# EAGLE board Keyboard (EAGLE 6.3)
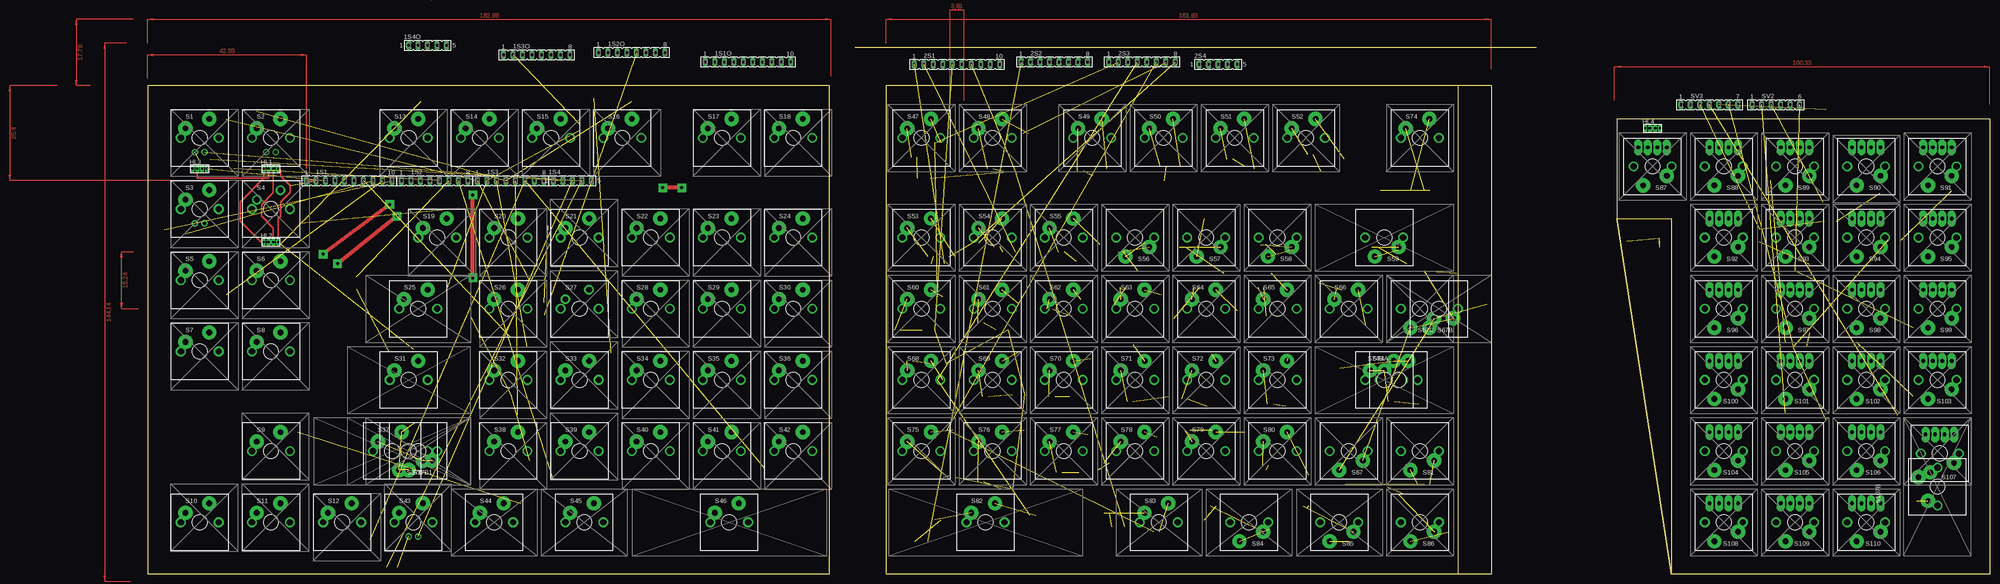
[diagram p2: board, top side]
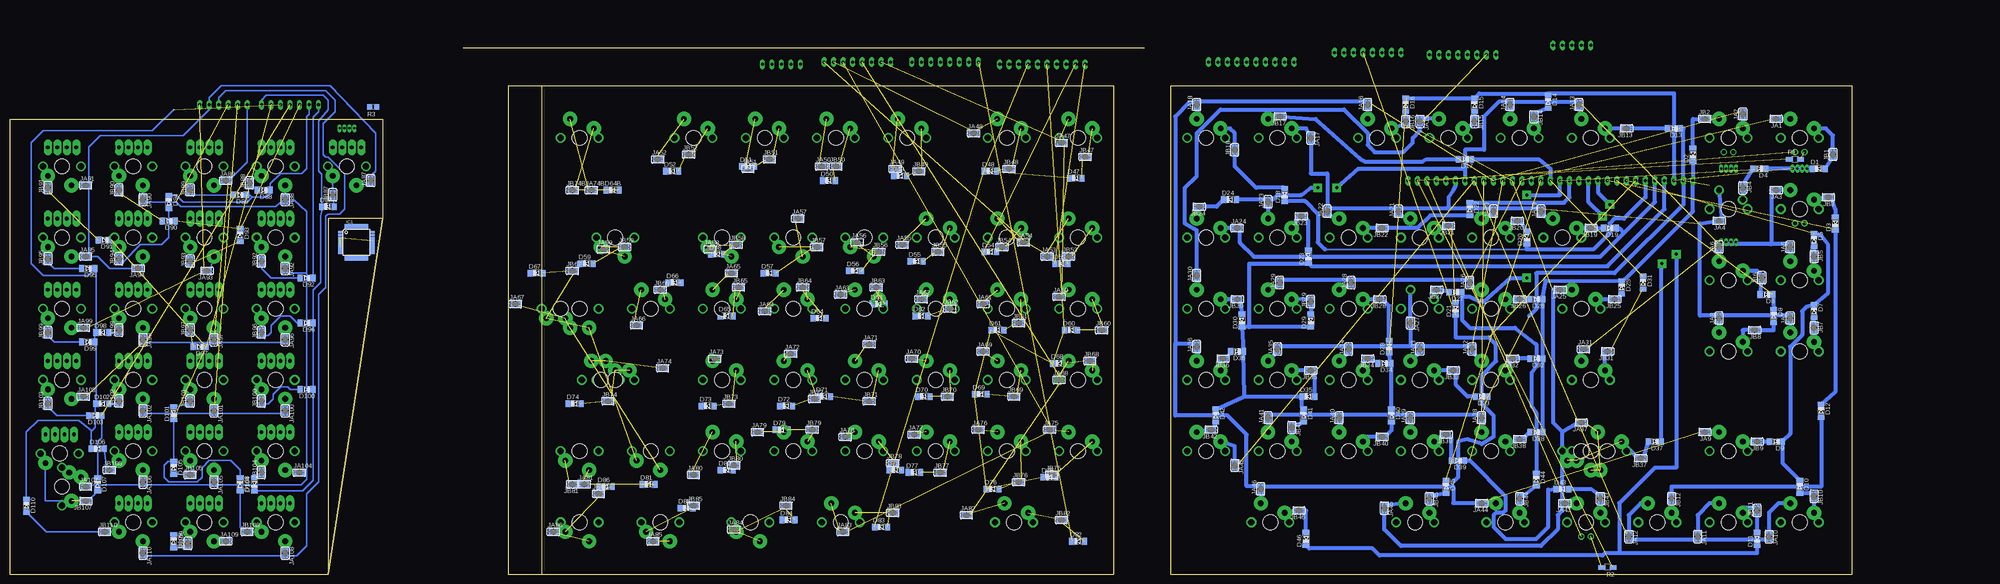
[diagram p3: board, bottom side, seen from below]

Size 492.76 x 140.97 mm. Coordinates in mm from the lower left corner, seen from the top.
Outline: 350.52,130.81 359.41,130.81 359.41,0 350.52,0
Outline: 350.52,130.81 197.49,130.81 197.49,0 350.52,0
Outline: 393.06,95.25 393.06,121.92 492.76,121.92 492.76,0 407.67,0
Outline: 371.48,140.97 189.23,140.97
Outline: 393.06,95.25 407.67,95.25 407.67,0
Outline: 393.06,95.25 407.67,0
Outline: 350.52,130.81 350.52,0
Outline: 182.25,130.81 182.25,0 0,0 0,130.81 182.25,130.81
Copper layers (1*16): Top 0.035mm / dielectric 1.5mm / Bottom 0.035mm
Design rules "default": minimum track width 10mil, minimum drill 24mil, track to track 8mil, track to pad 8mil, pad to pad 8mil, via to via 8mil, smd to smd 8mil, copper to edge 40mil, drill to drill 8mil, minimum pad ring 10mil, minimum via ring 8mil, stop-mask expansion 4mil, vias tented up to drill 0mil, thermal gap 10mil

## Footprints (pad centres in the part's own frame; a part is rotated, then mirrored left to right if it is on the bottom)
FE10 = drill 0.813 long: 1 -11.43,0; 2 -8.89,0; 3 -6.35,0; 4 -3.81,0; 5 -1.27,0; 6 1.27,0; 7 3.81,0; 8 6.35,0; 9 8.89,0; 10 11.43,0
FE08 = drill 0.813 long: 1 -8.89,0; 2 -6.35,0; 3 -3.81,0; 4 -1.27,0; 5 1.27,0; 6 3.81,0; 7 6.35,0; 8 8.89,0
FE05-1 = drill 0.813 long: 1 -5.08,0; 2 -2.54,0; 3 0,0; 4 2.54,0; 5 5.08,0
SOD80C = smd 1.4 x 1.8 bottom: A -1.7,0; C 1.7,0
RGB2X5 = drill 0.6 long: 1 -1.95,-0.585; 2 -0.65,-0.585; 3 0.65,-0.585; 4 1.95,-0.585
TQFP32-08 = smd 1.27 x 0.559: 1 -4.293,2.8; 2 -4.293,2; 3 -4.293,1.2; 4 -4.293,0.4; 5 -4.293,-0.4; 6 -4.293,-1.2; 7 -4.293,-2; 8 -4.293,-2.8; 17 4.293,-2.8; 18 4.293,-2; 19 4.293,-1.2; 20 4.293,-0.4; 21 4.293,0.4; 22 4.293,1.2; 23 4.293,2; 24 4.293,2.8 | smd 0.559 x 1.27: 9 -2.8,-4.293; 10 -2,-4.293; 11 -1.2,-4.293; 12 -0.4,-4.293; 13 0.4,-4.293; 14 1.2,-4.293; 15 2,-4.293; 16 2.8,-4.293; 25 2.8,4.293; 26 2,4.293; 27 1.2,4.293; 28 0.4,4.293; 29 -0.4,4.293; 30 -1.2,4.293; 31 -2,4.293; 32 -2.8,4.293
SJ = smd 1.168 x 1.6: 1 -0.762,0; 2 0.762,0
SJ' = smd 1.168 x 1.6 bottom: 1 0.762,0; 2 -0.762,0
R1206W = smd 1.8 x 1.2: 1 -1.499,0; 2 1.499,0
R0805 = smd 1.3 x 1.5: 1 -0.95,0; 2 0.95,0
CHERRY-MX-LED = drill 1.016 pad 1.676: LED1 -1.27,-3.81; LED2 1.27,-3.81 | drill 0.8 pad 1.27: P$1 0,0 | drill 1.714 pad 1.93: P$3 -5.08,0; P$4 5.08,0 | drill 1.5 pad 3.81: SW1 -3.81,2.54; SW2 2.54,5.08 | hole 4: 0,0
CHERRY-MX@1 = drill 1.714 pad 1.93: P$3 -5.08,0; P$4 5.08,0 | drill 1.5 pad 2.54: SW1 -3.81,2.54; SW2 2.54,5.08 | hole 4: 0,0
CHERRY-MX = drill 0.8: P$1 0,0 | drill 1.714 pad 1.93: P$3 -5.08,0; P$4 5.08,0 | drill 1.5 pad 3.81: SW1 -3.81,2.54; SW2 2.54,5.08 | hole 4: 0,0
CHERRY-MX-4P = drill 1.016 pad 2.184 long: D1 -3.81,-5.08; D2 3.81,-5.08; LED1 -1.27,-5.08; LED2 1.27,-5.08 | drill 1.714 pad 1.93: P$3 -5.08,0; P$4 5.08,0 | drill 1.5 pad 3.81: SW1 -3.81,2.54; SW2 2.54,5.08 | hole 4: 0,0
FE06 = drill 0.813 long: 1 -6.35,0; 2 -3.81,0; 3 -1.27,0; 4 1.27,0; 5 3.81,0; 6 6.35,0
FE07 = drill 0.813 long: 1 -7.62,0; 2 -5.08,0; 3 -2.54,0; 4 0,0; 5 2.54,0; 6 5.08,0; 7 7.62,0

## Placement (x,y rotation side)
1S1  [FE10]  53.97,105.41 0 top
1S1O  [FE10]  160.66,137.16 0 top
1S2  [FE08]  76.83,105.41 0 top
1S2O  [FE08]  129.54,139.7 0 top
1S3  [FE08]  97.16,105.41 0 top
1S3O  [FE08]  104.14,139.06 0 top
1S4  [FE05-1]  113.66,105.41 0 top
1S4O  [FE05-1]  74.93,141.61 0 top
2S1  [FE10]  216.54,136.52 0 top
2S2  [FE08]  242.57,137.16 0 top
2S3  [FE08]  266.06,137.16 0 top
2S4  [FE05-1]  286.38,136.52 0 top
D1  LL4148  [SOD80C]  8.89,108.58 0 top
D2  LL4148  [SOD80C]  42.55,112.39 270 top
D3  LL4148  [SOD80C]  4.45,93.98 270 top
D4  LL4148  [SOD80C]  24.77,108.58 180 top
D5  LL4148  [SOD80C]  10.16,89.53 90 top
D6  LL4148  [SOD80C]  22.86,74.93 180 top
D7  LL4148  [SOD80C]  10.16,70.48 90 top
D8  LL4148  [SOD80C]  20.96,69.22 90 top
D9  LL4148  [SOD80C]  20.32,35.56 180 top
D10  LL4148  [SOD80C]  13.97,23.49 90 top
D11  LL4148  [SOD80C]  25.4,9.52 270 top
D12  LL4148  [SOD80C]  8.25,43.81 90 top
D13  LL4148  [SOD80C]  47.62,119.38 180 top
D14  LL4148  [SOD80C]  81.28,126.53 90 top
D15  LL4148  [SOD80C]  100.97,125.73 90 top
D16  LL4148  [SOD80C]  119.38,125.73 90 top
D17  LL4148  [SOD80C]  103.5,111.12 180 top
D18  LL4148  [SOD80C]  151.77,101.6 270 top
D19  LL4148  [SOD80C]  64.77,92.71 180 top
D20  LL4148  [SOD80C]  86.99,90.17 270 top
D21  LL4148  [SOD80C]  106.05,71.12 270 top
D22  LL4148  [SOD80C]  102.23,97.79 90 top
D23  LL4148  [SOD80C]  145.42,85.09 270 top
D24  LL4148  [SOD80C]  166.37,100.33 0 top
D25  LL4148  [SOD80C]  61.59,76.83 90 top
D26  LL4148  [SOD80C]  84.45,73.66 180 top
D27  LL4148  [SOD80C]  106.05,75.56 180 top
D28  LL4148  [SOD80C]  123.83,60.96 270 top
D29  LL4148  [SOD80C]  144.78,67.94 270 top
D30  LL4148  [SOD80C]  163.2,67.94 270 top
D31  LL4148  [SOD80C]  55.88,78.11 90 top
D32  LL4148  [SOD80C]  84.45,57.78 180 top
D33  LL4148  [SOD80C]  99.06,47.62 180 top
D34  LL4148  [SOD80C]  125.09,56.52 180 top
D35  LL4148  [SOD80C]  145.42,47.62 0 top
D36  LL4148  [SOD80C]  164.47,59.69 180 top
D37  LL4148  [SOD80C]  52.7,35.56 180 top
D38  LL4148  [SOD80C]  84.45,38.1 180 top
D39  LL4148  [SOD80C]  105.41,30.48 180 top
D40  LL4148  [SOD80C]  123.19,42.55 90 top
D41  LL4148  [SOD80C]  146.69,42.55 90 top
D42  LL4148  [SOD80C]  170.18,42.55 90 top
D43  LL4148  [SOD80C]  77.47,22.86 0 top
D44  LL4148  [SOD80C]  84.45,25.4 90 top
D45  LL4148  [SOD80C]  108.58,23.49 90 top
D46  LL4148  [SOD80C]  146.05,9.52 270 top
D47  LL4148  [SOD80C]  207.65,106.05 0 top
D48  LL4148  [SOD80C]  230.51,107.95 0 top
D49  LL4148  [SOD80C]  254.63,106.68 0 top
D50  LL4148  [SOD80C]  273.69,105.41 0 top
D51  LL4148  [SOD80C]  295.28,109.22 0 top
D52  LL4148  [SOD80C]  315.6,107.95 0 top
D53  LL4148  [SOD80C]  211.46,83.19 0 top
D54  LL4148  [SOD80C]  230.51,86.36 0 top
D55  LL4148  [SOD80C]  250.19,83.82 0 top
D56  LL4148  [SOD80C]  266.7,81.28 0 top
D57  LL4148  [SOD80C]  289.56,80.64 0 top
D58  LL4148  [SOD80C]  303.53,85.72 0 top
D59  LL4148  [SOD80C]  338.45,83.19 0 top
D60  LL4148  [SOD80C]  208.92,65.41 0 top
D61  LL4148  [SOD80C]  228.6,65.41 0 top
D62  LL4148  [SOD80C]  248.92,69.22 0 top
D63  LL4148  [SOD80C]  260.35,72.39 0 top
D64  LL4148  [SOD80C]  276.23,68.58 0 top
D64B  LL4148  [SOD80C]  331.47,102.87 0 top
D65  LL4148  [SOD80C]  300.99,69.22 0 top
D66  LL4148  [SOD80C]  314.96,78.11 0 top
D67  LL4148  [SOD80C]  351.79,80.64 0 top
D68  LL4148  [SOD80C]  212.09,56.52 0 top
D69  LL4148  [SOD80C]  233.05,48.26 0 top
D70  LL4148  [SOD80C]  248.29,47.62 0 top
D71  LL4148  [SOD80C]  274.95,47.62 0 top
D72  LL4148  [SOD80C]  285.12,45.09 0 top
D73  LL4148  [SOD80C]  306.07,45.09 0 top
D74  LL4148  [SOD80C]  341.63,45.72 0 top
D75  LL4148  [SOD80C]  214.63,26.03 0 top
D76  LL4148  [SOD80C]  229.87,22.86 0 top
D77  LL4148  [SOD80C]  250.82,27.3 0 top
D78  LL4148  [SOD80C]  255.91,27.94 0 top
D79  LL4148  [SOD80C]  286.38,38.73 0 top
D80  LL4148  [SOD80C]  300.99,27.94 0 top
D81  LL4148  [SOD80C]  321.94,24.13 0 top
D82  LL4148  [SOD80C]  207.01,8.89 0 top
D83  LL4148  [SOD80C]  259.72,12.7 0 top
D84  LL4148  [SOD80C]  284.48,14.61 0 top
D85  LL4148  [SOD80C]  311.79,17.78 0 top
D86  LL4148  [SOD80C]  333.38,23.49 0 top
D87  LL4148  [SOD80C]  407.67,98.42 0 top
D88  LL4148  [SOD80C]  424.81,102.87 180 top
D89  LL4148  [SOD80C]  431.17,101.6 180 top
D90  LL4148  [SOD80C]  450.22,94.61 180 top
D91  LL4148  [SOD80C]  467.36,89.53 180 top
D92  LL4148  [SOD80C]  413.38,79.38 180 top
D93  LL4148  [SOD80C]  431.17,90.8 90 top
D94  LL4148  [SOD80C]  450.22,99.69 90 top
D95  LL4148  [SOD80C]  471.81,81.92 180 top
D96  LL4148  [SOD80C]  413.38,67.31 180 top
D97  LL4148  [SOD80C]  441.96,60.96 180 top
D98  LL4148  [SOD80C]  468,64.77 0 top
D99  LL4148  [SOD80C]  471.81,62.23 180 top
D100  LL4148  [SOD80C]  413.38,49.53 180 top
D101  LL4148  [SOD80C]  448.94,43.18 270 top
D102  LL4148  [SOD80C]  468,45.72 0 top
D103  LL4148  [SOD80C]  469.9,42.55 180 top
D104  LL4148  [SOD80C]  427.36,24.13 270 top
D105  LL4148  [SOD80C]  448.94,28.58 90 top
D106  LL4148  [SOD80C]  469.26,33.66 0 top
D107  LL4148  [SOD80C]  469.26,24.13 90 top
D108  LL4148  [SOD80C]  431.17,24.13 90 top
D109  LL4148  [SOD80C]  448.94,8.89 90 top
D110  LL4148  [SOD80C]  488.31,18.41 90 top
HL1  [RGB2X5]  33.02,109.22 0 top
HL2  [RGB2X5]  33.02,89.53 0 top
HL3  [RGB2X5]  13.97,109.22 0 top
HL4  [RGB2X5]  402.59,120.02 0 top
IC1  MEGA8-AI  [TQFP32-08]  400.05,88.9 0 bottom
JA1  [SJ]  20.32,121.92 180 bottom
JA2  [SJ]  29.21,123.19 90 bottom
JA3  [SJ]  20.32,102.87 180 bottom
JA4  [SJ]  35.56,94.61 180 bottom
JA5  [SJ]  16.51,87.63 90 bottom
JA6  [SJ]  35.56,87.63 90 bottom
JA7  [SJ]  16.51,68.58 90 bottom
JA8  [SJ]  35.56,68.58 90 bottom
JA9  [SJ]  39.37,38.1 180 bottom
JA10  [SJ]  22.22,10.16 270 bottom
JA11  [SJ]  41.28,10.16 270 bottom
JA12  [SJ]  59.69,10.16 270 bottom
JA13  [SJ']  73.02,125.73 270 top
JA14  [SJ']  91.44,125.73 270 top
JA15  [SJ']  115.57,121.29 90 top
JA16  [SJ']  129.54,125.73 270 top
JA17  [SJ']  144.78,116.84 90 top
JA18  [SJ']  175.26,125.73 270 top
JA19  [SJ']  83.19,97.16 270 top
JA20  [SJ']  95.88,97.16 270 top
JA21  [SJ']  121.29,97.16 270 top
JA22  [SJ']  140.34,97.16 270 top
JA23  [SJ']  156.21,99.69 270 top
JA24  [SJ']  164.47,92.71 0 top
JA25  [SJ']  78.11,76.2 180 top
JA26  [SJ']  102.23,78.11 270 top
JA27  [SJ']  118.11,67.31 90 top
JA28  [SJ']  133.99,78.11 270 top
JA29  [SJ']  153.04,78.11 270 top
JA30  [SJ']  175.26,80.01 270 top
JA31  [SJ']  71.75,60.33 0 top
JA32  [SJ']  101.6,60.33 270 top
JA33  [SJ']  115.57,60.33 270 top
JA34  [SJ']  134.62,60.33 270 top
JA35  [SJ']  153.67,60.33 270 top
JA36  [SJ']  175.26,60.96 270 top
JA37  [SJ']  72.39,40.64 180 top
JA38  [SJ']  99.06,41.91 270 top
JA39  [SJ']  118.11,41.91 270 top
JA40  [SJ']  137.16,41.91 270 top
JA41  [SJ']  156.21,41.91 270 top
JA42  [SJ']  165.1,29.21 90 top
JA43  [SJ']  76.83,19.05 180 top
JA44  [SJ']  99.06,19.05 180 top
JA45  [SJ']  125.09,17.78 90 top
JA46  [SJ']  158.12,22.86 270 top
JA47  [SJ']  211.46,115.57 0 top
JA48  [SJ']  234.95,118.11 0 top
JA49  [SJ']  255.91,108.58 0 top
JA50  [SJ']  275.59,109.22 0 top
JA51  [SJ']  295.28,108.58 0 top
JA52  [SJ']  319.41,111.12 0 top
JA53  [SJ']  215.27,85.09 0 top
JA54  [SJ']  221.62,88.9 0 top
JA55  [SJ']  254,88.27 0 top
JA56  [SJ']  266.06,88.9 0 top
JA57  [SJ']  281.94,95.25 0 top
JA58  [SJ']  305.44,87 0 top
JA59  [SJ']  334.01,87 0 top
JA60  [SJ']  212.09,74.3 0 top
JA61  [SJ']  232.41,72.39 0 top
JA62  [SJ']  248.92,73.66 0 top
JA63  [SJ']  270.51,74.93 0 top
JA64  [SJ']  290.83,70.48 0 top
JA65  [SJ']  299.72,80.64 0 top
JA66  [SJ']  325.12,66.67 0 top
JA67  [SJ']  357.5,72.39 0 top
JA68  [SJ']  212.09,52.07 0 top
JA69  [SJ']  232.41,59.69 0 top
JA70  [SJ']  251.46,57.78 0 top
JA71  [SJ']  262.89,61.59 0 top
JA72  [SJ']  283.85,59.05 0 top
JA73  [SJ']  304.17,57.78 0 top
JA74  [SJ']  318.13,55.25 0 top
JA74B  [SJ']  337.19,102.87 0 top
JA75  [SJ']  214.63,38.73 0 top
JA76  [SJ']  233.68,38.73 0 top
JA77  [SJ']  250.82,37.46 0 top
JA78  [SJ']  269.24,36.83 0 top
JA79  [SJ']  292.74,38.1 0 top
JA80  [SJ']  309.88,26.67 0 top
JA81  [SJ']  339.09,24.13 0 top
JA82  [SJ']  236.86,15.88 0 top
JA83  [SJ']  269.88,11.43 0 top
JA84  [SJ']  299.09,12.06 0 top
JA85  [SJ']  320.68,8.89 0 top
JA86  [SJ']  347.35,11.43 0 top
JA87  [SJ']  396.24,105.41 270 top
JA88  [SJ']  419.1,100.33 90 top
JA89  [SJ']  434.98,105.41 0 top
JA90  [SJ']  457.2,100.33 90 top
JA91  [SJ']  472.44,104.14 0 top
JA92  [SJ']  419.1,81.92 90 top
JA93  [SJ']  440.06,81.28 180 top
JA94  [SJ']  458.47,81.92 180 top
JA95  [SJ']  472.44,85.09 0 top
JA96  [SJ']  419.1,62.86 90 top
JA97  [SJ']  438.15,62.86 90 top
JA98  [SJ']  457.2,62.86 90 top
JA99  [SJ']  473.07,66.04 0 top
JA100  [SJ']  419.1,43.81 90 top
JA101  [SJ']  438.15,43.81 90 top
JA102  [SJ']  457.2,43.81 90 top
JA103  [SJ']  473.07,47.62 0 top
JA104  [SJ']  415.29,27.3 0 top
JA105  [SJ']  438.15,24.77 90 top
JA106  [SJ']  457.2,24.77 90 top
JA107  [SJ']  472.44,23.49 0 top
JA108  [SJ']  419.1,5.71 90 top
JA109  [SJ']  434.98,8.89 0 top
JA110  [SJ']  457.2,5.71 90 top
JB1  [SJ']  5.08,112.39 270 top
JB2  [SJ]  39.37,121.92 0 bottom
JB3  [SJ']  6.35,100.97 180 top
JB4  [SJ]  29.21,103.5 270 bottom
JB5  [SJ]  10.16,85.09 270 bottom
JB6  [SJ]  24.13,79.38 90 bottom
JB7  [SJ]  10.16,66.04 270 bottom
JB8  [SJ]  26.04,65.41 180 bottom
JB9  [SJ]  25.4,35.56 180 bottom
JB10  [SJ]  10.16,20.95 270 bottom
JB11  [SJ]  25.4,17.14 90 bottom
JB12  [SJ]  48.26,20.32 270 bottom
JB13  [SJ]  60.33,119.38 180 bottom
JB14  [SJ]  85.09,122.55 270 bottom
JB15  [SJ]  100.97,121.29 270 bottom
JB16  [SJ]  119.38,121.29 270 bottom
JB17  [SJ]  153.04,122.55 180 bottom
JB18  [SJ']  165.1,113.67 270 top
JB19  [SJ']  69.85,92.71 180 top
JB20  [SJ']  89.53,94.61 180 top
JB21  [SJ']  107.95,93.34 180 top
JB22  [SJ']  125.73,92.71 180 top
JB23  [SJ']  147.32,95.89 180 top
JB24  [SJ']  174.62,98.42 180 top
JB25  [SJ']  63.5,73.66 180 top
JB26  [SJ']  88.9,73.66 180 top
JB27  [SJ']  111.12,76.2 180 top
JB28  [SJ']  126.36,73.66 180 top
JB29  [SJ']  144.78,73.03 270 top
JB30  [SJ']  164.47,73.66 180 top
JB31  [SJ']  65.41,59.69 180 top
JB32  [SJ']  90.8,57.78 180 top
JB33  [SJ']  106.68,54.61 180 top
JB34  [SJ']  129.54,57.78 180 top
JB35  [SJ']  144.78,54.61 180 top
JB36  [SJ']  168.28,57.78 180 top
JB37  [SJ']  56.52,31.12 180 top
JB38  [SJ']  88.9,36.2 180 top
JB39  [SJ']  108.58,37.46 180 top
JB40  [SJ']  125.73,36.83 180 top
JB41  [SJ']  149.86,39.37 90 top
JB42  [SJ']  171.45,38.73 180 top
JB43  [SJ']  67.31,20.32 90 top
JB44  [SJ']  88.9,20.32 90 top
JB45  [SJ']  113.03,20.32 90 top
JB46  [SJ']  147.96,17.14 180 top
JB47  [SJ']  205.11,111.76 0 top
JB48  [SJ']  225.43,108.58 0 top
JB49  [SJ']  249.56,107.95 0 top
JB50  [SJ']  271.78,109.22 0 top
JB51  [SJ']  289.56,111.12 0 top
JB52  [SJ']  311.15,112.39 0 top
JB53  [SJ']  209.55,85.09 0 top
JB54  [SJ']  227.33,87.63 0 top
JB55  [SJ']  244.48,86.36 0 top
JB56  [SJ']  260.35,86.36 0 top
JB57  [SJ']  276.86,87.63 0 top
JB58  [SJ']  298.45,88.27 0 top
JB59  [SJ']  328.3,87.63 0 top
JB60  [SJ']  200.66,65.41 0 top
JB61  [SJ']  222.89,67.31 0 top
JB62  [SJ']  241.3,71.12 0 top
JB63  [SJ']  260.99,76.83 0 top
JB64  [SJ']  280.67,76.83 0 top
JB65  [SJ']  297.81,76.83 0 top
JB66  [SJ']  318.77,76.2 0 top
JB67  [SJ']  342.26,81.28 0 top
JB68  [SJ']  203.84,57.15 0 top
JB69  [SJ']  224.16,47.62 0 top
JB70  [SJ']  241.94,47.62 0 top
JB71  [SJ']  262.89,46.35 0 top
JB72  [SJ']  277.5,46.99 0 top
JB73  [SJ']  300.36,45.72 0 top
JB74  [SJ']  332.74,46.35 0 top
JB74B  [SJ']  342.26,102.87 0 top
JB75  [SJ']  214,26.67 0 top
JB76  [SJ']  222.89,24.77 0 top
JB77  [SJ']  243.84,27.3 0 top
JB78  [SJ']  256.54,29.84 0 top
JB79  [SJ']  278.13,38.73 0 top
JB80  [SJ']  299.09,29.21 0 top
JB81  [SJ']  342.26,24.13 180 top
JB82  [SJ']  211.46,14.61 0 top
JB83  [SJ']  256.54,16.51 0 top
JB84  [SJ']  285.12,18.41 0 top
JB85  [SJ']  309.88,18.41 0 top
JB86  [SJ']  335.28,21.59 0 top
JB87  [SJ']  406.4,101.6 270 top
JB88  [SJ']  428.62,104.78 270 top
JB89  [SJ']  444.5,102.87 270 top
JB90  [SJ']  463.55,102.87 270 top
JB91  [SJ']  482.6,103.5 270 top
JB92  [SJ']  425.45,83.82 270 top
JB93  [SJ']  444.5,83.82 270 top
JB94  [SJ']  463.55,84.45 270 top
JB95  [SJ']  482.6,84.45 270 top
JB96  [SJ']  425.45,64.77 270 top
JB97  [SJ']  444.5,65.41 270 top
JB98  [SJ']  463.55,65.41 270 top
JB99  [SJ']  482.6,64.77 270 top
JB100  [SJ']  425.45,46.35 270 top
JB101  [SJ']  444.5,46.35 270 top
JB102  [SJ']  463.55,46.35 270 top
JB103  [SJ']  482.6,45.72 270 top
JB104  [SJ']  425.45,27.3 270 top
JB105  [SJ']  444.5,26.67 0 top
JB106  [SJ']  466.09,27.94 0 top
JB107  [SJ']  472.44,19.68 180 top
JB108  [SJ']  429.26,11.43 0 top
JB109  [SJ']  445.13,8.25 270 top
JB110  [SJ']  467.36,11.43 0 top
R1  1k  [R1206W]  15.24,111.12 0 bottom
R2  1k  [R1206W]  65.41,1.9 180 bottom
R3  1k  [R0805]  395.61,125.1 180 bottom
S1  Scroll Lock  [CHERRY-MX-LED]  13.97,116.84 0 top
S2  ESC  [CHERRY-MX-LED]  33.02,116.84 0 top
S3  Ins  [CHERRY-MX-LED]  13.97,97.79 0 top
S4  Pause  [CHERRY-MX@1]  33.02,97.79 0 top
S5  Home  [CHERRY-MX]  13.97,78.74 0 top
S6  P Up  [CHERRY-MX]  33.02,78.74 0 top
S7  End  [CHERRY-MX]  13.97,59.69 0 top
S8  P Dn  [CHERRY-MX]  33.02,59.69 0 top
S9  Up  [CHERRY-MX]  33.02,33.02 0 top
S10  Left  [CHERRY-MX]  13.97,13.97 0 top
S11  Down  [CHERRY-MX]  33.02,13.97 0 top
S12  Right  [CHERRY-MX]  52.07,13.97 0 top
S13  F1  [CHERRY-MX]  69.85,116.84 0 top
S14  F2  [CHERRY-MX]  88.9,116.84 0 top
S15  F3  [CHERRY-MX]  107.95,116.84 0 top
S16  F4  [CHERRY-MX]  127,116.84 0 top
S17  F5  [CHERRY-MX]  153.67,116.84 0 top
S18  F6  [CHERRY-MX]  172.72,116.84 0 top
S19  1  [CHERRY-MX]  77.47,90.17 0 top
S20  2  [CHERRY-MX]  96.52,90.17 0 top
S21  3  [CHERRY-MX]  115.57,90.17 0 top
S22  4  [CHERRY-MX]  134.62,90.17 0 top
S23  5  [CHERRY-MX]  153.67,90.17 0 top
S24  6  [CHERRY-MX]  172.72,90.17 0 top
S25  TAB  [CHERRY-MX]  72.39,71.12 0 top
S26  Q  [CHERRY-MX]  96.52,71.12 0 top
S27  W  [CHERRY-MX@1]  115.57,71.12 0 top
S28  E  [CHERRY-MX]  134.62,71.12 0 top
S29  R  [CHERRY-MX]  153.67,71.12 0 top
S30  T  [CHERRY-MX]  172.72,71.12 0 top
S31  LCtrl  [CHERRY-MX]  69.85,52.07 0 top
S32  A  [CHERRY-MX]  96.52,52.07 0 top
S33  S  [CHERRY-MX]  115.57,52.07 0 top
S34  D  [CHERRY-MX]  134.62,52.07 0 top
S35  F  [CHERRY-MX]  153.67,52.07 0 top
S36  G  [CHERRY-MX]  172.72,52.07 0 top
S37  L Shift  [CHERRY-MX]  65.41,33.02 0 top
S37B  L Shift  [CHERRY-MX]  69.85,33.02 180 top
S37B1  L Shift  [CHERRY-MX]  72.39,33.02 180 top
S38  Z  [CHERRY-MX]  96.52,33.02 0 top
S39  X  [CHERRY-MX]  115.57,33.02 0 top
S40  C  [CHERRY-MX]  134.62,33.02 0 top
S41  V  [CHERRY-MX]  153.67,33.02 0 top
S42  B  [CHERRY-MX]  172.72,33.02 0 top
S43  Caps Lock  [CHERRY-MX-LED]  71.12,13.97 0 top
S44  Alt  [CHERRY-MX]  92.71,13.97 0 top
S45  Menu(Win)  [CHERRY-MX]  116.84,13.97 0 top
S46  Space  [CHERRY-MX]  155.58,13.97 0 top
S47  F7  [CHERRY-MX]  207.01,116.84 0 top
S48  F8  [CHERRY-MX]  226.06,116.84 0 top
S49  F9  [CHERRY-MX]  252.73,116.84 0 top
S50  F10  [CHERRY-MX]  271.78,116.84 0 top
S51  F11  [CHERRY-MX]  290.83,116.84 0 top
S52  F12  [CHERRY-MX]  309.88,116.84 0 top
S53  7  [CHERRY-MX]  207.01,90.17 0 top
S54  8  [CHERRY-MX]  226.06,90.17 0 top
S55  9  [CHERRY-MX]  245.11,90.17 0 top
S56  0  [CHERRY-MX]  264.16,90.17 180 top
S57  -  [CHERRY-MX]  283.21,90.17 180 top
S58  =  [CHERRY-MX]  302.26,90.17 180 top
S59  BS  [CHERRY-MX]  330.84,90.17 180 top
S60  Y  [CHERRY-MX]  207.01,71.12 0 top
S61  U  [CHERRY-MX]  226.06,71.12 0 top
S62  I  [CHERRY-MX]  245.11,71.12 0 top
S63  O  [CHERRY-MX]  264.16,71.12 0 top
S64  P  [CHERRY-MX]  283.21,71.12 0 top
S65  [  [CHERRY-MX]  302.26,71.12 0 top
S66  ]  [CHERRY-MX]  321.31,71.12 0 top
S67  |  [CHERRY-MX]  321.31,33.02 180 top
S67B  |  [CHERRY-MX]  345.44,71.12 180 top
S67C  |  [CHERRY-MX]  340.36,71.12 180 top
S68  H  [CHERRY-MX]  207.01,52.07 0 top
S69  J  [CHERRY-MX]  226.06,52.07 0 top
S70  K  [CHERRY-MX]  245.11,52.07 0 top
S71  L  [CHERRY-MX]  264.16,52.07 0 top
S72  :  [CHERRY-MX]  283.21,52.07 0 top
S73  "  [CHERRY-MX]  302.26,52.07 0 top
S74  Del  [CHERRY-MX]  340.36,116.84 0 top
S74A  Enter  [CHERRY-MX]  334.65,52.07 0 top
S74B  Enter  [CHERRY-MX]  330.84,52.07 0 top
S75  N  [CHERRY-MX]  207.01,33.02 0 top
S76  M  [CHERRY-MX]  226.06,33.02 0 top
S77  <  [CHERRY-MX]  245.11,33.02 0 top
S78  >  [CHERRY-MX]  264.16,33.02 0 top
S79  ~  [CHERRY-MX]  283.21,33.02 0 top
S80  ?  [CHERRY-MX]  302.26,33.02 0 top
S81  R Shift  [CHERRY-MX]  340.36,33.02 180 top
S82  Space  [CHERRY-MX]  224.16,13.97 0 top
S83  Mouse2(Menu)  [CHERRY-MX]  270.51,13.97 0 top
S84  Alt  [CHERRY-MX]  294.64,13.97 180 top
S85  RCtrl  [CHERRY-MX]  318.77,13.97 180 top
S86  PrtScr  [CHERRY-MX]  340.36,13.97 180 top
S87  Num  [CHERRY-MX-4P]  402.59,109.22 180 top
S88  D  [CHERRY-MX-4P]  421.64,109.22 180 top
S89  E  [CHERRY-MX-4P]  440.69,109.22 180 top
S90  F  [CHERRY-MX-4P]  459.74,109.22 180 top
S91  /  [CHERRY-MX-4P]  478.79,109.22 180 top
S92  A  [CHERRY-MX-4P]  421.64,90.17 180 top
S93  B  [CHERRY-MX-4P]  440.69,90.17 180 top
S94  C  [CHERRY-MX-4P]  459.74,90.17 180 top
S95  *  [CHERRY-MX-4P]  478.79,90.17 180 top
S96  7  [CHERRY-MX-4P]  421.64,71.12 180 top
S97  8  [CHERRY-MX-4P]  440.69,71.12 180 top
S98  9  [CHERRY-MX-4P]  459.74,71.12 180 top
S99  -  [CHERRY-MX-4P]  478.79,71.12 180 top
S100  4  [CHERRY-MX-4P]  421.64,52.07 180 top
S101  5  [CHERRY-MX-4P]  440.69,52.07 180 top
S102  6  [CHERRY-MX-4P]  459.74,52.07 180 top
S103  +  [CHERRY-MX-4P]  478.79,52.07 180 top
S104  1  [CHERRY-MX-4P]  421.64,33.02 180 top
S105  2  [CHERRY-MX-4P]  440.69,33.02 180 top
S106  3  [CHERRY-MX-4P]  459.74,33.02 180 top
S107  NumEnter  [CHERRY-MX-4P]  479.43,32.38 180 top
S107B  NumEnter  [CHERRY-MX]  478.79,23.49 90 top
S108  0  [CHERRY-MX-4P]  421.64,13.97 180 top
S109  00  [CHERRY-MX-4P]  440.69,13.97 180 top
S110  .  [CHERRY-MX-4P]  459.74,13.97 180 top
SV2  [FE06]  435.61,125.73 0 top
SV3  [FE07]  417.83,125.73 0 top
U$1  [18X18]  13.97,116.84 0 top
U$2  [18X18]  33.02,116.84 0 top
U$3  [18X18]  13.97,97.79 0 top
U$4  [18X18]  13.97,78.74 0 top
U$5  [18X18]  33.02,97.79 0 top
U$6  [18X18]  13.97,59.69 0 top
U$7  [18X18]  33.02,78.74 0 top
U$8  [18X18]  33.02,59.69 0 top
U$9  [18X18]  52.07,13.97 0 top
U$10  [18X18]  33.02,13.97 90 top
U$11  [18X18]  33.02,33.02 90 top
U$12  [18X18]  115.57,33.02 90 top
U$13  [18X18]  13.97,13.97 90 top
U$14  [18X18]  71.12,13.97 90 top
U$15  [18X23]  92.71,13.97 0 top
U$16  [18X23]  116.84,13.97 0 top
U$17  [18X52]  155.58,13.97 0 top
U$18  [18X18]  96.52,33.02 0 top
U$19  [18X18]  172.72,33.02 0 top
U$20  [18X18]  153.67,33.02 0 top
U$21  [18X18]  134.62,33.02 0 top
U$22  [18X42]  65.41,33.02 0 top
U$23  [18X18]  115.57,52.07 90 top
U$24  [18X18]  96.52,52.07 0 top
U$25  [18X18]  172.72,52.07 0 top
U$26  [18X18]  153.67,52.07 0 top
U$27  [18X18]  134.62,52.07 0 top
U$28  [18X33]  69.85,52.07 0 top
U$29  [18X18]  115.57,71.12 90 top
U$30  [18X18]  96.52,71.12 0 top
U$31  [18X18]  172.72,71.12 0 top
U$32  [18X18]  153.67,71.12 0 top
U$33  [18X18]  134.62,71.12 0 top
U$34  [18X28]  72.39,71.12 0 top
U$35  [18X18]  115.57,90.17 90 top
U$36  [18X18]  96.52,90.17 0 top
U$37  [18X18]  172.72,90.17 0 top
U$38  [18X18]  153.67,90.17 0 top
U$39  [18X18]  134.62,90.17 0 top
U$40  [18X18]  77.47,90.17 0 top
U$41  [18X18]  172.72,116.84 0 top
U$42  [18X18]  153.67,116.84 0 top
U$43  [18X18]  107.95,116.84 0 top
U$44  [18X18]  127,116.84 0 top
U$45  [18X18]  88.9,116.84 0 top
U$46  [18X18]  69.85,116.84 0 top
U$47  [18X18]  205.74,118.11 0 top
U$48  [18X18]  224.79,118.11 0 top
U$49  [18X18]  289.56,118.11 0 top
U$50  [18X18]  251.46,118.11 0 top
U$51  [18X18]  270.51,118.11 0 top
U$52  [18X18]  308.61,118.11 0 top
U$53  [18X18]  205.74,91.44 0 top
U$54  [18X18]  224.79,91.44 0 top
U$55  [18X18]  243.84,91.44 0 top
U$56  [18X18]  262.89,91.44 0 top
U$57  [18X18]  281.94,91.44 0 top
U$58  [18X18]  300.99,91.44 0 top
U$59  [18X18]  205.74,72.39 0 top
U$60  [18X18]  224.79,72.39 0 top
U$61  [18X18]  243.84,72.39 0 top
U$62  [18X18]  262.89,72.39 0 top
U$63  [18X18]  281.94,72.39 0 top
U$64  [18X18]  300.99,72.39 0 top
U$65  [18X18]  320.04,72.39 0 top
U$66  [18X18]  339.09,72.39 0 top
U$67  [18X18]  205.74,53.34 0 top
U$68  [18X18]  224.79,53.34 0 top
U$69  [18X18]  243.84,53.34 0 top
U$70  [18X18]  262.89,53.34 0 top
U$71  [18X18]  281.94,53.34 0 top
U$72  [18X18]  300.99,53.34 0 top
U$73  [18X18]  205.74,34.29 0 top
U$74  [18X18]  224.79,34.29 0 top
U$75  [18X18]  243.84,34.29 0 top
U$76  [18X18]  262.89,34.29 0 top
U$77  [18X18]  281.94,34.29 0 top
U$78  [18X18]  300.99,34.29 0 top
U$79  [18X52]  224.16,13.97 0 top
U$80  [18X37]  330.84,90.17 0 top
U$83  [18X18]  339.09,15.24 0 top
U$84  [18X23]  318.77,13.97 0 top
U$85  [18X23]  294.64,13.97 0 top
U$86  [18X23]  270.51,13.97 0 top
U$87  [18X18]  401.32,110.49 0 top
U$88  [18X18]  420.37,110.49 0 top
U$89  [18X18]  439.42,110.49 0 top
U$90  [18X18]  458.47,109.86 0 top
U$91  [18X18]  477.52,110.49 0 top
U$92  [18X18]  477.52,91.44 0 top
U$93  [18X18]  458.47,91.44 0 top
U$94  [18X18]  439.42,91.44 0 top
U$95  [18X18]  420.37,91.44 0 top
U$96  [18X18]  420.37,72.39 0 top
U$97  [18X18]  439.42,72.39 0 top
U$98  [18X18]  458.47,72.39 0 top
U$99  [18X18]  477.52,72.39 0 top
U$100  [18X18]  420.37,53.34 0 top
U$101  [18X18]  439.42,53.34 0 top
U$102  [18X18]  458.47,53.34 0 top
U$103  [18X18]  477.52,53.34 0 top
U$104  [18X18]  420.37,34.29 0 top
U$105  [18X18]  439.42,34.29 0 top
U$106  [18X18]  458.47,34.29 0 top
U$107  [18X18]  477.52,34.29 0 top
U$108  [18X18]  420.37,15.24 0 top
U$109  [18X18]  439.42,15.24 0 top
U$110  [18X18]  458.47,15.24 0 top
U$111  [37X18]  478.79,23.49 0 top
U$112  [18X37]  330.84,52.07 0 top
U$113  [18X28]  345.44,71.12 0 top
U$114  [18X33]  69.85,33.02 0 top
U$115  [18X28]  72.39,33.02 0 top
U$116  [18X18]  339.09,118.11 0 top
U$117  [18X18]  320.04,34.29 0 top
U$118  [18X18]  339.09,34.29 0 top

## Tracks (layer width: path | path; a pad name or v marks a point on that pad's centre or on a via)
2A2  (2 unrouted)
2A4  (2 unrouted)
2A6  (2 unrouted)
2A7  (1 unrouted)
2A8  (2 unrouted)
2B0  (1 unrouted)
2B1  (1 unrouted)
2B4  (6 unrouted)
2B6  (3 unrouted)
2B10  (1 unrouted)
3A1  (2 unrouted)
  Bottom 0.406: JA96.2 JA97.2 JA98.2 | SV2.1 429.26,110.36 JA89.2
3A2  (1 unrouted)
  Bottom 0.406: JA100.2 JA101.2 JA102.2
3A3  (1 unrouted)
  Bottom 0.406: JA107.2 470.28,24 JA106.2 JA105.2 414.78,24 413.38,25.4 413.38,27.3 | 413.38,27.3 413.38,80.64 | 413.38,80.64 419.1,80.64 JA92.2 | 413.38,27.3 JA104.2 | 413.38,80.64 413.38,97.16 416.69,100.2 JA88.2 420.5,99.57 421.64,98.42 447.04,98.42 448.31,99.69 457.07,99.69 JA90.2
3A4
  Bottom 0.406: JA110.2 JA108.2 416.05,4.95 413.38,7.62 413.38,21.59 410.21,24.77 410.21,74.93 408.31,76.83 408.31,95.89 407.67,96.52 404.5,96.52 403.23,97.79 403.23,107.31 407.67,111.76 408.31,111.76 408.94,112.39 408.94,120.65 405.76,123.83 405.76,127 408.31,129.54 434.98,129.54 436.88,127.64 SV2.4
3A5
  Bottom 0.406: JA87.2 396.24,106.68 394.97,107.95 394.97,118.11 407.04,130.81 436.25,130.81 439.42,127.64 SV2.5 439.42,124.46 446.41,117.47 468.63,117.47 471.68,114.43 JA91.2 JA95.2 469.26,85.09 466.09,81.92 JA94.2
3A6  (2 unrouted)
3B0
  Bottom 0.406: D92.C 411.69,122.35 410.21,123.83 SV3.1
3B2
  Bottom 0.406: SV3.2 412.75,123.19 413.38,122.55 413.38,108.58 414.66,107.31 420.37,107.31 423.12,104.57 D88.C 423.12,102.03 424.18,100.97 427.99,100.97 | D89.C 428.62,101.6 427.99,100.97 | D94.C 448.11,101.39 446.41,99.69 429.26,99.69 427.99,100.97
3B3  (2 unrouted)
3B7  (1 unrouted)
  Bottom 0.406: D107.C 469.26,35.56 468.2,36.62 D103.C
3B8  (1 unrouted)
  Bottom 0.406: 469.69,81.5 D98.C 470.11,64.36 D99.C 469.69,61.82 D102.C 469.9,45.52 469.9,39.37 470.85,38.42 | 469.69,81.5 D95.C | D106.C 470.97,38.3 470.85,38.42 | D110.C 488.31,38.1 485.14,41.27 474.35,41.27 470.85,38.42 | 469.69,81.5 470.31,81.5 471.81,80.01 483.87,80.01 487.05,83.19 487.05,115.57 483.87,118.75 454.66,118.75 448.94,124.46
3B9  (3 unrouted)
  Bottom 0.406: D101.C D105.C 450.42,30.27 451.49,29.21 451.49,26.03 450.22,24.77 442.6,24.77 441.32,26.03 441.32,28.58 439.42,30.48 433.7,30.48 431.17,27.94 D108.C
3B10
  Bottom 0.406: D104.C 414.45,22.43 411.69,25.2 D100.C D96.C 411.69,76.2 409.57,78.11 409.57,95.89 409.37,97.16 D87.C 409.37,107.11 410.21,107.95 410.21,121.29 407.67,124.46 407.67,127 408.94,128.27 424.18,128.27 425.45,127 SV3.7
+5V_K1  (2 unrouted)
A1  (2 unrouted)
  Bottom 1.016: JA26.2 JA28.2 JA29.2
A2  (3 unrouted)
  Bottom 1.016: JA25.2 80.01,76.2 80.01,40.64 77.47,38.1 | 77.47,38.1 77.47,19.18 JA43.2 77.6,17.02 78.74,15.88 78.74,12.06 83.19,7.62 120.65,7.62 125.09,12.06 JA45.2 | 77.47,38.1 JA37.2 | JA30.2 175.26,92.08 178.44,93.98 178.44,103.5 175.26,106.68 175.26,118.11 168.91,124.46 135.89,124.46 129.54,118.11 129.54,114.94 127.64,113.03 120.02,113.03 117.48,115.57 117.48,116.84 115.57,118.75 JA15.2
A3  (1 unrouted)
  Bottom 1.016: JA32.2 JA33.2 118.11,61.09 | 118.11,61.09 JA34.2 JA35.2 | JA27.2 118.11,61.09
A4  (3 unrouted)
  Bottom 1.016: JA16.2 JA18.2 175.26,126.36 177.17,126.36 180.98,122.55 180.98,61.72 | JA36.2 180.98,61.72 | JA44.2 106.68,19.05 106.68,23.49 106.81,23.62 JA46.2 161.93,23.62 161.93,37.46 167.01,42.55 180.98,42.55 180.98,61.59 180.98,61.72
A5  (1 unrouted)
  Bottom 1.016: JA38.2 JA39.2 JA40.2 JA41.2
A6  (2 unrouted)
  Bottom 1.016: JA12.2 JA11.2 JA10.2
A7  (via drill 0.8 pad 2.3)  (2 unrouted)
  Top 1.016: v142.88,103.5 v137.8,103.5
  Bottom 1.016: JA5.2 21.59,88.39 | 21.59,88.39 JA6.2 | JA3.2 21.59,102.87 21.59,88.39 | JA13.2 JA14.2 94.49,126.49 98.42,122.55 98.42,113.67 103.5,113.67 103.5,108.58 | 103.5,108.58 1S3.7 | D24.A 164.54,100.46 JA23.2 154.81,100.46 153.67,101.6 147.32,101.6 144.78,103.5 v142.88,103.5 | v137.8,103.5 132.08,108.58 103.5,108.58
A8  (1 unrouted)
  Bottom 1.016: JA7.2 JA8.2 40.64,69.34 | 40.64,69.34 40.64,69.22 | 40.64,69.34 40.64,93.98 JA4.2 | 107.95,97.92 JA20.2 JA19.2 | 107.95,97.92 JA21.2 JA22.2 140.34,107.31 144.78,107.31 JA17.2 | 1S3.8 106.05,104.14 106.68,102.87 107.95,100.97 107.95,97.92
B0
  Bottom 1.016: D38.C D32.C D26.C 81.91,78.74 D25.C 60.33,79.38 42.55,97.16 1S1.1 D2.C
B1  (3 unrouted)
  Top 0.406: HL2.4 34.97,95.3 35.56,95.89 35.56,99.69 38.1,102.23 38.1,104.14 35.56,106.68 35.56,108.05 HL1.4
  Bottom 1.016: D13.C 45.08,119.38 1S1.2 45.08,99.06 63.5,80.64 84.45,80.64 84.45,71.12 86.36,69.22 | D39.C 102.23,30.48 92.71,20.95 92.71,17.14 93.34,16.51 95.25,16.51 95.88,15.88 95.88,12.7 92.71,9.52 84.45,9.52 81.28,12.7 81.28,22.66 D43.C
B2  (2 unrouted)
  Bottom 1.016: D28.C D34.C 123.19,56.31 D40.C | 1S1.3 47.62,128.7 81.28,128.7 | D14.C 81.28,128.7 | D16.C D15.C 99.69,128.7 81.28,128.7
B3
  Bottom 1.016: D42.C 162.8,47.52 | 162.8,47.52 162.56,47.62 D36.C D30.C 161.29,66.25 | D29.C 161.29,66.25 | 161.29,66.25 161.29,83.19 145.62,83.19 D23.C 144.58,82.55 65.41,82.55 50.17,97.79 1S1.4 | D41.C 147.12,44.67 D35.C 147.22,47.52 162.8,47.52
B4
  Bottom 1.016: 60.96,91.44 67.31,85.09 160.02,85.09 163.7,88.77 JA24.2 | 60.96,91.44 52.7,99.69 1S1.5 | D19.C 62.23,92.71 60.96,91.44
B5
  Bottom 0.406: 140.97,87 86.99,87
  Bottom 1.016: 140.97,87 142.88,88.9 142.88,96.52 146.26,99.9 D18.C | D20.C 86.99,87 69.22,87 64.77,91.44 64.77,93.98 63.5,95.25 60.96,95.25 55.24,100.97 1S1.6
B6  (2 unrouted)
  Bottom 1.016: D21.C 106.05,63.5 97.16,63.5 95.25,61.59 95.25,57.15 99.06,53.34 99.06,45.72 95.88,42.55 95.88,36.83 99.06,34.92 102.87,36.2 105.41,35.56 105.41,26.03 106.25,25.2
B7  (1 unrouted)
  Bottom 1.016: D10.C 18.62,29.84 D9.C 16.51,37.67 16.51,60.96 13.34,64.14 13.34,70.48 12.27,71.55 D7.C 6.35,75.36 6.35,88.27 8.25,90.8 9.32,90.8 D5.C
B8  (1 unrouted)
  Bottom 1.016: D6.C D8.C
B9  (1 unrouted)
  Bottom 1.016: D3.C 4.45,48.89 D12.C
B10  (via drill 0.8 pad 2.3)
  Top 1.016: v64.77,99.06 v46.99,85.72
  Bottom 1.016: D11.C 25.4,5.71 62.23,5.71 | 62.23,5.71 66.04,5.71 66.67,5.08 126.36,5.08 128.27,6.98 145.21,6.98 D46.C | 1S2.1 67.94,102.23 v64.77,99.06 | v46.99,85.72 46.99,28.58 52.7,28.58 62.23,19.05 62.23,5.71
B11  (via drill 0.8 pad 2.3)
  Top 1.016: v50.8,83.19 v66.67,95.89
  Bottom 1.016: D37.C 51,83.39 v50.8,83.19 | v66.67,95.89 70.48,99.69 1S2.2
B13
  Bottom 1.016: D22.C 77.04,99.49 75.56,100.97 1S2.4
B14  (via drill 0.8 pad 2.3)  (1 unrouted)
  Top 1.016: v86.99,79.38 v86.99,101.6
  Bottom 1.016: D1.C D4.C | D27.C 104.34,74.3 | 104.34,74.3 104.34,68.15 102.23,66.04 90.17,66.04 84.45,61.59 84.45,55.88 85.72,53.98 85.72,45.09 84.45,43.18 D44.C | v86.99,79.38 91.44,79.38 98.42,73.03 99.69,73.03 102.23,74.3 104.34,74.3 | v86.99,101.6 78.11,101.6 1S2.5
B15  (1 unrouted)
  Bottom 1.016: D17.C 83.82,111.12 80.64,108.58 1S2.6
B16  (1 unrouted)
G1
  Top 0.406: HL2.3 33.67,92.69 30.48,95.89 30.48,99.06 33.66,102.23 33.66,108.62 HL1.3
GND  (2 unrouted)
K1
  Top 0.406: HL3.2 13.32,106.06 13.34,106.05 32.39,106.05 32.39,108.62 HL1.2
LED_CAPS  (1 unrouted)
LED_SCR  (1 unrouted)
N$1
  Bottom 1.016: D15.A JB15.1
N$2
  Bottom 1.016: JB4.2 S4.SW1
N$3
  Bottom 1.016: D1.A JB1.1
N$4
  Bottom 1.016: S4.SW2 JA4.1
N$5
  Bottom 1.016: JB14.2 S14.SW1
N$6
  Bottom 1.016: JB20.2 S20.SW1
N$7
  Bottom 1.016: JB32.2 91.57,55.75 S32.SW1
N$8
  Bottom 1.016: JB38.2 90.3,35.56 S38.SW1
N$9
  Bottom 1.016: JB6.2 25.4,81.28 S6.SW1
N$10
  Bottom 1.016: JA6.1 S6.SW2
N$11
  Bottom 1.016: JA8.1 S8.SW2
N$12
  Bottom 1.016: JB8.2 29.21,65.41 S8.SW1
N$13
  Bottom 1.016: JB10.2 S10.SW1
N$14
  Bottom 1.016: JB1.2 5.08,117.47 6.98,119.38 S1.SW1
N$15
  Bottom 1.016: D2.A 42.55,121.92 JB2.1
N$16
  Bottom 1.016: S2.SW2 JB2.2
N$17
  Bottom 1.016: JA2.1 S2.SW1
N$18
  Bottom 1.016: JB16.1 D16.A
N$19
  Bottom 1.016: JB3.2 S3.SW1
N$20
  Bottom 1.016: JB5.2 S5.SW1
N$21
  Bottom 1.016: JB7.2 S7.SW1
N$22
  Bottom 1.016: S9.SW1 JB9.2
N$23
  Bottom 1.016: JB11.2 29.21,17.78 S11.SW1
N$24
  Bottom 1.016: D3.A 4.45,97.79 JB3.1
N$25
  Bottom 1.016: JB12.2 S12.SW1
N$26
  Bottom 1.016: D5.A JB5.1
N$27
  Bottom 1.016: JB7.1 D7.A
N$28
  Bottom 1.016: S10.SW2 19.68,19.05 22.22,16.51 JA10.1
N$29
  Bottom 1.016: S1.SW2 JA1.1
N$30
  Bottom 1.016: JB9.1 D9.A
N$31
  Bottom 1.016: JB11.1 D11.A
N$32
  Bottom 1.016: S3.SW2 JA3.1
N$33
  Bottom 1.016: JA5.1 S5.SW2
N$34
  Bottom 1.016: JA7.1 S7.SW2
N$35
  Bottom 1.016: S9.SW2 JA9.1
N$36
  Bottom 1.016: S11.SW2 38.1,19.05 41.28,15.88 JA11.1
N$37
  Bottom 1.016: S12.SW2 56.52,19.05 59.69,15.88 JA12.1
N$38
  Bottom 1.016: JA14.1 S14.SW2
N$39
  Bottom 1.016: JB13.2 S13.SW1
N$40
  Bottom 1.016: JA13.1 S13.SW2
N$41
  Bottom 1.016: D14.A JB14.1
N$42
  Bottom 1.016: JB42.2 S42.SW2
N$43
  Bottom 1.016: JA42.1 165.1,34.29 S42.SW1
N$44
  Bottom 1.016: JB27.2 S27.SW1
N$45
  Bottom 1.016: JA27.1 S27.SW2
N$46
  Bottom 1.016: JB17.2 S17.SW2
N$47
  Bottom 1.016: JA17.1 146.05,119.38 S17.SW1
N$48
  Bottom 1.016: D24.C 169.98,98.42 JB24.1
N$49
  Bottom 1.016: JB24.2 175.26,98.3 S24.SW2
N$50
  Bottom 1.016: JA24.1 S24.SW1
N$51
  Bottom 0.406: JA107.1 S107B.SW2 S107.SW2
N$52
  Bottom 1.016: D4.A JB4.1
N$53
  Bottom 1.016: D6.A JB6.1
N$54
  Bottom 1.016: JB8.1 20.96,65.41 D8.A
N$55
  Bottom 1.016: JB10.1 13.89,21.72 D10.A
N$56
  Bottom 1.016: D12.A 8.25,23.49 48.26,23.49 JB12.1
N$57
  Bottom 1.016: D13.A JB13.1
N$58
  Bottom 1.016: S19.SW1 JB19.2
N$59
  Bottom 1.016: JB25.2 S25.SW1
N$60
  Bottom 0.406: JB104.1 D104.A
N$61
  Bottom 1.016: S31.SW1 JB31.2
N$62  (2 unrouted)
  Bottom 1.016: S37.SW1 JB37.2
N$63
  Bottom 1.016: JB43.2 S43.SW1
N$64
  Bottom 1.016: JB26.2 S26.SW1
N$65
  Bottom 1.016: JB44.2 S44.SW1
N$66
  Bottom 1.016: JB18.2 165.1,118.11 166.37,119.38 S18.SW1
N$68
  Bottom 1.016: JB30.2 S30.SW1
N$69
  Bottom 1.016: JB36.2 S36.SW1
N$70  (1 unrouted)
N$71  (1 unrouted)
N$72
  Bottom 1.016: JB23.2 S23.SW1
N$73
  Bottom 1.016: JB29.2 S29.SW1
N$74
  Bottom 1.016: JB35.2 S35.SW1
N$75
  Bottom 1.016: JB41.2 S41.SW1
N$76
  Bottom 1.016: JB16.2 S16.SW1
N$77
  Bottom 1.016: JB22.2 S22.SW1
N$78
  Bottom 1.016: JB28.2 S28.SW1
N$79
  Bottom 1.016: JB34.2 S34.SW1
N$80
  Bottom 1.016: JB40.2 129.54,36.83 S40.SW1
N$81
  Bottom 1.016: JB46.2 S46.SW1
N$82
  Bottom 1.016: JB15.2 S15.SW1
N$83
  Bottom 1.016: S21.SW1 JB21.2
N$84  (1 unrouted)
N$85
  Bottom 1.016: JB33.2 S33.SW1
N$86
  Bottom 1.016: JB39.2 S39.SW1
N$87
  Bottom 1.016: JB45.2 S45.SW1
N$88
  Bottom 1.016: S15.SW2 110.62,122.05 JA15.1
N$89  (1 unrouted)
N$90
  Bottom 1.016: JA18.1 S18.SW2
N$91
  Bottom 1.016: JA20.1 S20.SW2
N$92
  Bottom 1.016: JA22.1 S22.SW2
N$93
  Bottom 1.016: JA23.1 S23.SW2
N$94  (2 unrouted)
N$95
  Bottom 1.016: JA25.1 S25.SW2
N$96
  Bottom 1.016: JA26.1 S26.SW2
N$97  (2 unrouted)
N$98
  Bottom 1.016: JA28.1 S28.SW2
N$99
  Bottom 1.016: JA29.1 S29.SW2
N$100
  Bottom 1.016: JA30.1 S30.SW2
N$101
  Bottom 1.016: S31.SW2 JA31.1
N$102
  Bottom 1.016: JA32.1 S32.SW2
N$103
  Bottom 1.016: JA33.1 S33.SW2
N$104
  Bottom 1.016: JA34.1 S34.SW2
N$105
  Bottom 1.016: JA35.1 S35.SW2
N$106
  Bottom 1.016: JA36.1 S36.SW2
N$107  (3 unrouted)
N$108
  Bottom 1.016: JA38.1 S38.SW2
N$109
  Bottom 1.016: JA39.1 S39.SW2
N$110
  Bottom 1.016: JA40.1 S40.SW2
N$111
  Bottom 1.016: JA41.1 S41.SW2
N$112  (1 unrouted)
N$113
  Bottom 1.016: S43.SW2 JA43.1
N$114
  Bottom 1.016: S45.SW2 JA45.1
N$115
  Bottom 1.016: JA46.1 S46.SW2
N$116
  Bottom 1.016: JA19.1 S19.SW2
N$117
  Bottom 1.016: S44.SW2 JA44.1
N$118
  Bottom 1.016: JA21.1 S21.SW2
N$119
  Bottom 1.016: S16.SW2 JA16.1
N$120
  Bottom 1.016: JB17.1 143.51,121.92 131.45,111.12 130.18,110.49 114.94,110.49 113.66,111.12 D17.A
N$121
  Bottom 1.016: D18.A 151.97,103.5 159.39,103.5 165.1,109.22 JB18.1
N$122
  Bottom 1.016: JB19.1 D19.A
N$123
  Bottom 1.016: JB20.1 D20.A
N$124  (1 unrouted)
N$125
  Bottom 1.016: D22.A 112.83,96.09 116.2,92.71 JB22.1
N$126
  Bottom 1.016: D23.A 145.42,94.61 JB23.1
N$127  (1 unrouted)
N$128
  Bottom 1.016: D25.A JB25.1
N$129
  Bottom 1.016: JB26.1 D26.A
N$130
  Bottom 1.016: D27.A JB27.1
N$131
  Bottom 1.016: D28.A 123.83,71.88 JB28.1
N$132
  Bottom 1.016: JB29.1 D29.A
N$133
  Bottom 1.016: JB30.1 D30.A
N$134  (1 unrouted)
N$135
  Bottom 1.016: D32.A JB32.1
N$136
  Bottom 1.016: D33.A 102.87,47.62 105.92,50.67 JB33.1
N$137
  Bottom 1.016: D34.A JB34.1
N$138
  Bottom 1.016: D35.A 143.72,54.31 JB35.1
N$139
  Bottom 1.016: D36.A JB36.1
N$140
  Bottom 1.016: JB37.1 D37.A
N$141
  Bottom 1.016: D38.A JB38.1
N$142
  Bottom 1.016: D39.A 107.11,36.12 JB39.1
N$143
  Bottom 1.016: D40.A 123.19,38.61 JB40.1
N$144
  Bottom 1.016: JB41.1 148.03,40.13 D41.A
N$145
  Bottom 1.016: JB42.1 D42.A
N$146
  Bottom 1.016: D43.A 69.72,22.86 JB43.1
N$147
  Bottom 1.016: D44.A 87.71,21.08 JB44.1
N$148
  Bottom 1.016: JB45.1 D45.A
N$149
  Bottom 1.016: D46.A 146.05,17.14 JB46.1
N$150  (1 unrouted)
N$151  (1 unrouted)
N$153  (1 unrouted)
N$154  (1 unrouted)
N$155  (1 unrouted)
N$156  (1 unrouted)
N$157  (1 unrouted)
N$158  (1 unrouted)
N$159  (1 unrouted)
N$160  (1 unrouted)
N$161  (1 unrouted)
N$162  (1 unrouted)
N$163  (1 unrouted)
N$164  (1 unrouted)
N$165  (1 unrouted)
N$166  (1 unrouted)
N$167  (1 unrouted)
N$168  (1 unrouted)
N$169  (1 unrouted)
N$170  (1 unrouted)
N$171  (1 unrouted)
N$172  (1 unrouted)
N$173  (1 unrouted)
N$174  (1 unrouted)
N$175  (1 unrouted)
N$176  (1 unrouted)
N$177  (1 unrouted)
N$178  (1 unrouted)
N$179  (1 unrouted)
N$180  (1 unrouted)
N$181  (1 unrouted)
N$182  (1 unrouted)
N$183  (1 unrouted)
N$184  (1 unrouted)
N$185  (3 unrouted)
N$186  (1 unrouted)
N$187  (1 unrouted)
N$188  (1 unrouted)
N$189  (1 unrouted)
N$190  (1 unrouted)
N$191  (1 unrouted)
N$192  (1 unrouted)
N$193  (1 unrouted)
N$194  (1 unrouted)
N$195  (1 unrouted)
N$196  (1 unrouted)
N$197  (1 unrouted)
N$198  (1 unrouted)
N$199  (1 unrouted)
N$200  (1 unrouted)
N$201  (1 unrouted)
N$202  (1 unrouted)
N$203  (1 unrouted)
N$204  (1 unrouted)
N$205  (1 unrouted)
N$206  (1 unrouted)
N$207  (1 unrouted)
N$208  (1 unrouted)
N$209  (1 unrouted)
N$210  (1 unrouted)
N$211  (1 unrouted)
N$212  (1 unrouted)
N$213  (1 unrouted)
N$214  (1 unrouted)
N$215  (1 unrouted)
N$216  (1 unrouted)
N$217  (1 unrouted)
N$218  (1 unrouted)
N$219  (1 unrouted)
N$220  (1 unrouted)
N$221  (1 unrouted)
N$222  (1 unrouted)
N$223  (1 unrouted)
N$224  (1 unrouted)
N$225  (1 unrouted)
N$226  (1 unrouted)
N$227  (1 unrouted)
N$228  (1 unrouted)
N$229  (1 unrouted)
N$230  (1 unrouted)
N$231  (1 unrouted)
N$232  (1 unrouted)
N$233  (1 unrouted)
N$234  (1 unrouted)
N$235  (1 unrouted)
N$236  (1 unrouted)
N$237  (1 unrouted)
N$238  (1 unrouted)
N$239  (1 unrouted)
N$240  (1 unrouted)
N$241  (1 unrouted)
N$242  (1 unrouted)
N$243  (1 unrouted)
N$244  (1 unrouted)
N$245  (1 unrouted)
N$246  (1 unrouted)
N$247  (1 unrouted)
N$248  (1 unrouted)
N$249  (1 unrouted)
N$250  (1 unrouted)
N$251  (1 unrouted)
N$252  (1 unrouted)
N$253  (1 unrouted)
N$254  (1 unrouted)
N$255  (1 unrouted)
N$256  (1 unrouted)
N$257  (1 unrouted)
N$258  (1 unrouted)
N$259  (1 unrouted)
N$260  (1 unrouted)
N$261  (1 unrouted)
N$262  (1 unrouted)
N$263  (1 unrouted)
N$264  (3 unrouted)
N$265  (1 unrouted)
N$266  (1 unrouted)
N$267  (1 unrouted)
N$268
  Bottom 0.406: JB87.1 D87.A
N$269
  Bottom 0.406: JB88.1 D88.A
N$270
  Bottom 0.406: JB87.2 S87.SW1
N$271
  Bottom 0.406: S88.SW1 JB88.2
N$272
  Bottom 0.406: S87.SW2 JA87.1
N$273
  Bottom 0.406: JA88.1 S88.SW2
N$274
  Bottom 0.406: D89.A 443.99,101.6 JB89.1
N$275
  Bottom 0.406: S89.SW1 JB89.2
N$276
  Bottom 0.406: S89.SW2 JA89.1
N$277  (1 unrouted)
N$278
  Bottom 0.406: S90.SW1 JB90.2
N$279
  Bottom 0.406: JA90.1 S90.SW2
N$280  (1 unrouted)
N$281
  Bottom 0.406: S91.SW1 JB91.2
N$282
  Bottom 0.406: JA91.1 S91.SW2
N$283
  Bottom 0.406: JB92.2 S92.SW1
N$284
  Bottom 0.406: D92.A 422.91,79.38 425.45,81.92 JB92.1
N$285
  Bottom 0.406: JA92.1 S92.SW2
N$286
  Bottom 0.406: S93.SW2 JA93.1
N$287
  Bottom 0.406: S93.SW1 JB93.2
N$288  (1 unrouted)
N$289
  Bottom 0.406: JB94.1 462.41,83.69 457.84,88.27 452.12,88.27 450.22,90.17 D94.A
N$290
  Bottom 0.406: S94.SW1 JB94.2
N$291
  Bottom 0.406: JA94.1 S94.SW2
N$292
  Bottom 0.406: D95.A 480.82,81.92 JB95.1
N$293
  Bottom 0.406: JB95.2 S95.SW1
N$294
  Bottom 0.406: S95.SW2 JA95.1
N$295
  Bottom 0.406: D96.A 415.93,67.31 417.83,69.22 420.37,69.22 422.91,66.67 422.91,64.77 423.67,64.01 JB96.1
N$296
  Bottom 0.406: JB96.2 S96.SW1
N$297
  Bottom 0.406: JA96.1 S96.SW2
N$298
  Bottom 0.406: S97.SW1 JB97.2
N$299
  Bottom 0.406: JA97.1 S97.SW2
N$300  (1 unrouted)
N$301
  Bottom 0.406: D98.A JB98.1
N$302
  Bottom 0.406: JB98.2 S98.SW1
N$303
  Bottom 0.406: JA98.1 S98.SW2
N$304
  Bottom 0.406: D99.A 480.82,62.23 JB99.1
N$305
  Bottom 0.406: JB99.2 S99.SW1
N$306
  Bottom 0.406: JA99.1 S99.SW2
N$307
  Bottom 0.406: D100.A 417.83,49.53 418.47,50.16 420.37,50.16 422.28,48.26 422.28,46.99 423.67,45.59 JB100.1
N$308
  Bottom 0.406: S100.SW1 JB100.2
N$309
  Bottom 0.406: JA100.1 S100.SW2
N$310
  Bottom 0.406: JB101.2 S101.SW1
N$311
  Bottom 0.406: D101.A JB101.1
N$312
  Bottom 0.406: JA101.1 S101.SW2
N$313
  Bottom 0.406: D102.A JB102.1
N$314
  Bottom 0.406: JB102.2 S102.SW1
N$315
  Bottom 0.406: JA102.1 S102.SW2
N$316
  Bottom 0.406: D103.A 480.19,42.55 JB103.1
N$317
  Bottom 0.406: JB103.2 S103.SW1
N$318
  Bottom 0.406: S103.SW2 JA103.1
N$319  (1 unrouted)
  Bottom 0.406: S107.SW1 483.24,19.68 S107B.SW1
N$320
  Bottom 0.406: JB104.2 S104.SW1
N$321
  Bottom 0.406: JA104.1 S104.SW2
N$322
  Bottom 0.406: JB105.2 S105.SW1
N$323
  Bottom 0.406: JB105.1 D105.A
N$324
  Bottom 0.406: JA105.1 S105.SW2
N$325
  Bottom 0.406: JB106.1 D106.A
N$326
  Bottom 0.406: S106.SW1 JB106.2
N$327
  Bottom 0.406: S106.SW2 JA106.1
N$328
  Bottom 0.406: JB107.1 D107.A
N$329
  Bottom 0.406: S108.SW1 JB108.2
N$330
  Bottom 0.406: JA108.1 S108.SW2
N$331
  Bottom 0.406: JB108.1 431.17,12.57 D108.A
N$332
  Bottom 0.406: S109.SW1 JB109.2
N$333
  Bottom 0.406: JB109.1 D109.A
N$334
  Bottom 0.406: JA109.1 S109.SW2
N$335
  Bottom 0.406: JB110.1 483.03,11.43 D110.A
N$336
  Bottom 0.406: S110.SW1 JB110.2
N$337
  Bottom 0.406: JA110.1 S110.SW2
R1
  Top 0.406: HL2.1 30.43,88.95 24.77,94.61 24.77,99.69 31.11,106.05 31.11,108.59 HL1.1
VCC  (1 unrouted)
(copper drawn outside any net)
  shapes: Top area x11